# EAGLE design 8bitPig-PigstyGates-BackPCB (EAGLE 9.2.2)
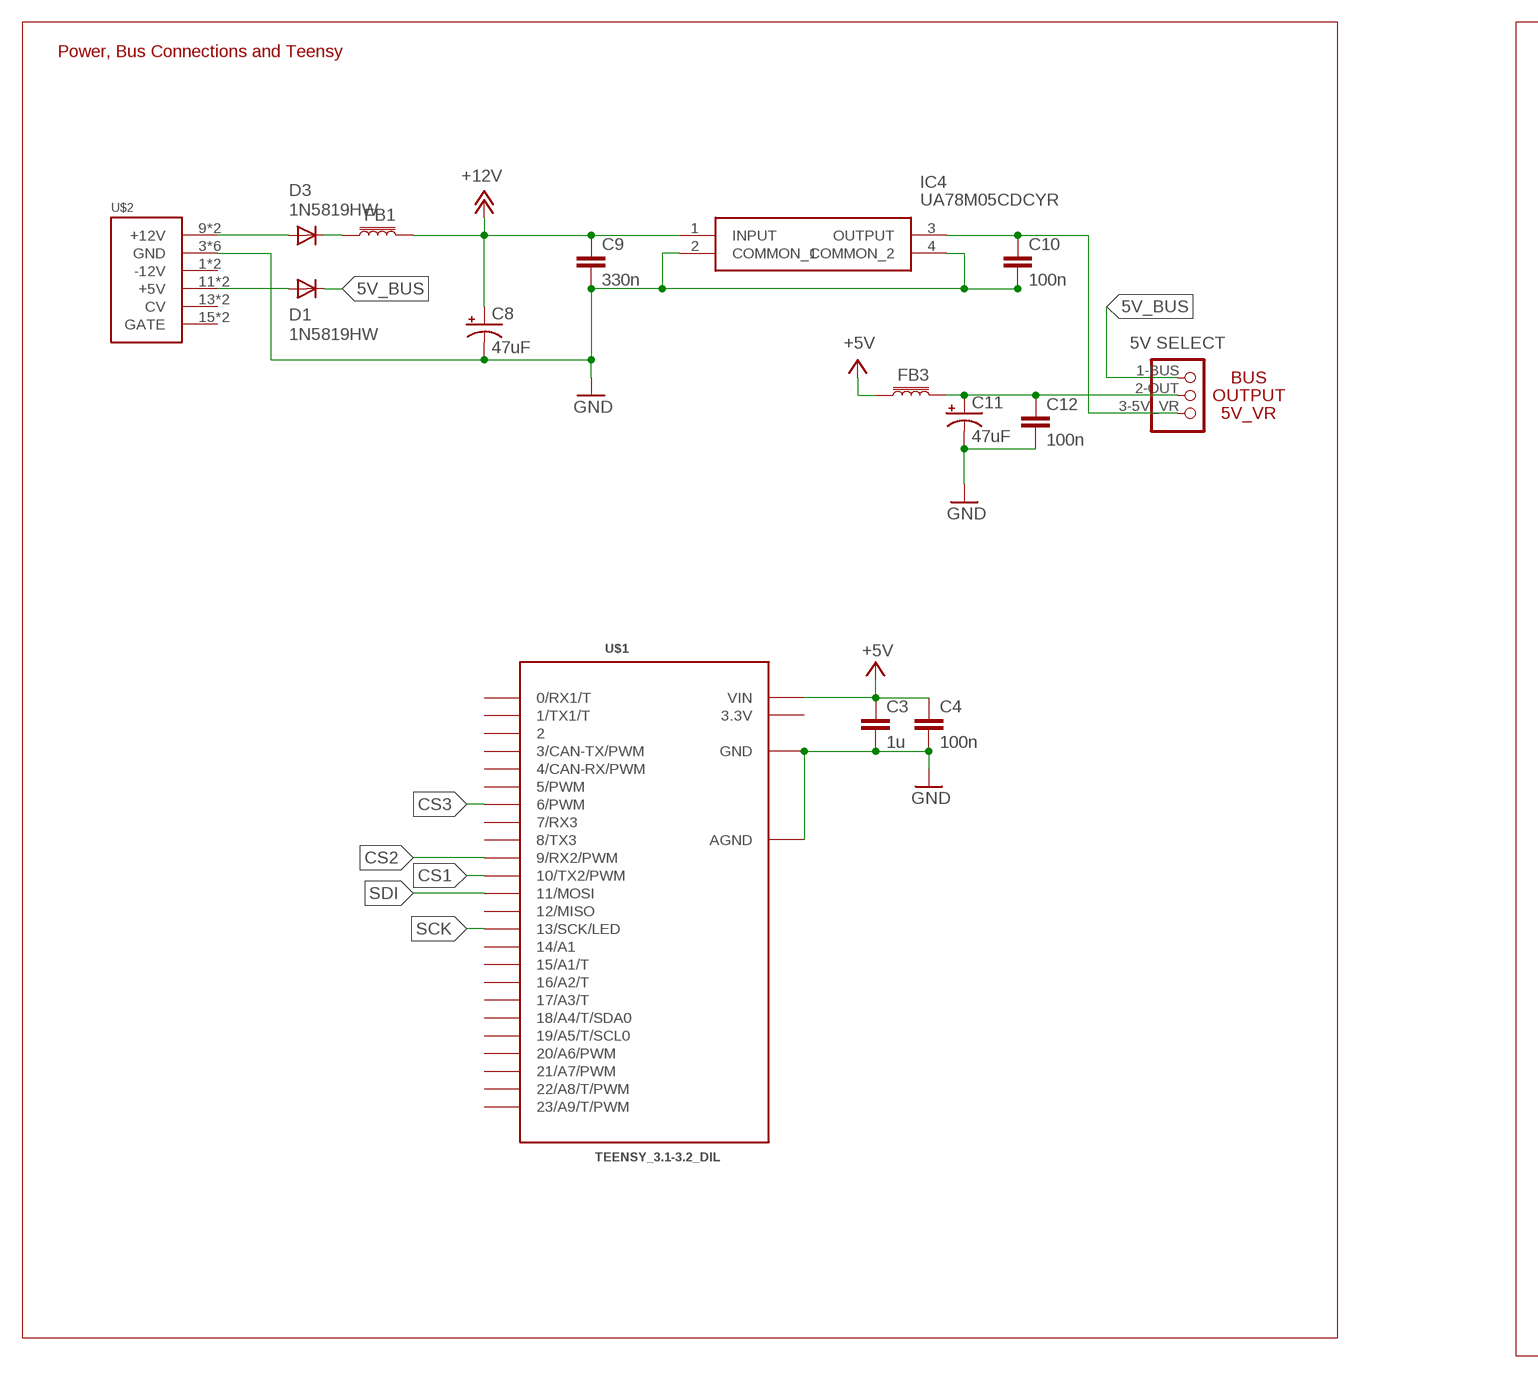
[diagram p0: schematic, sheet 1, part 1 of 2]
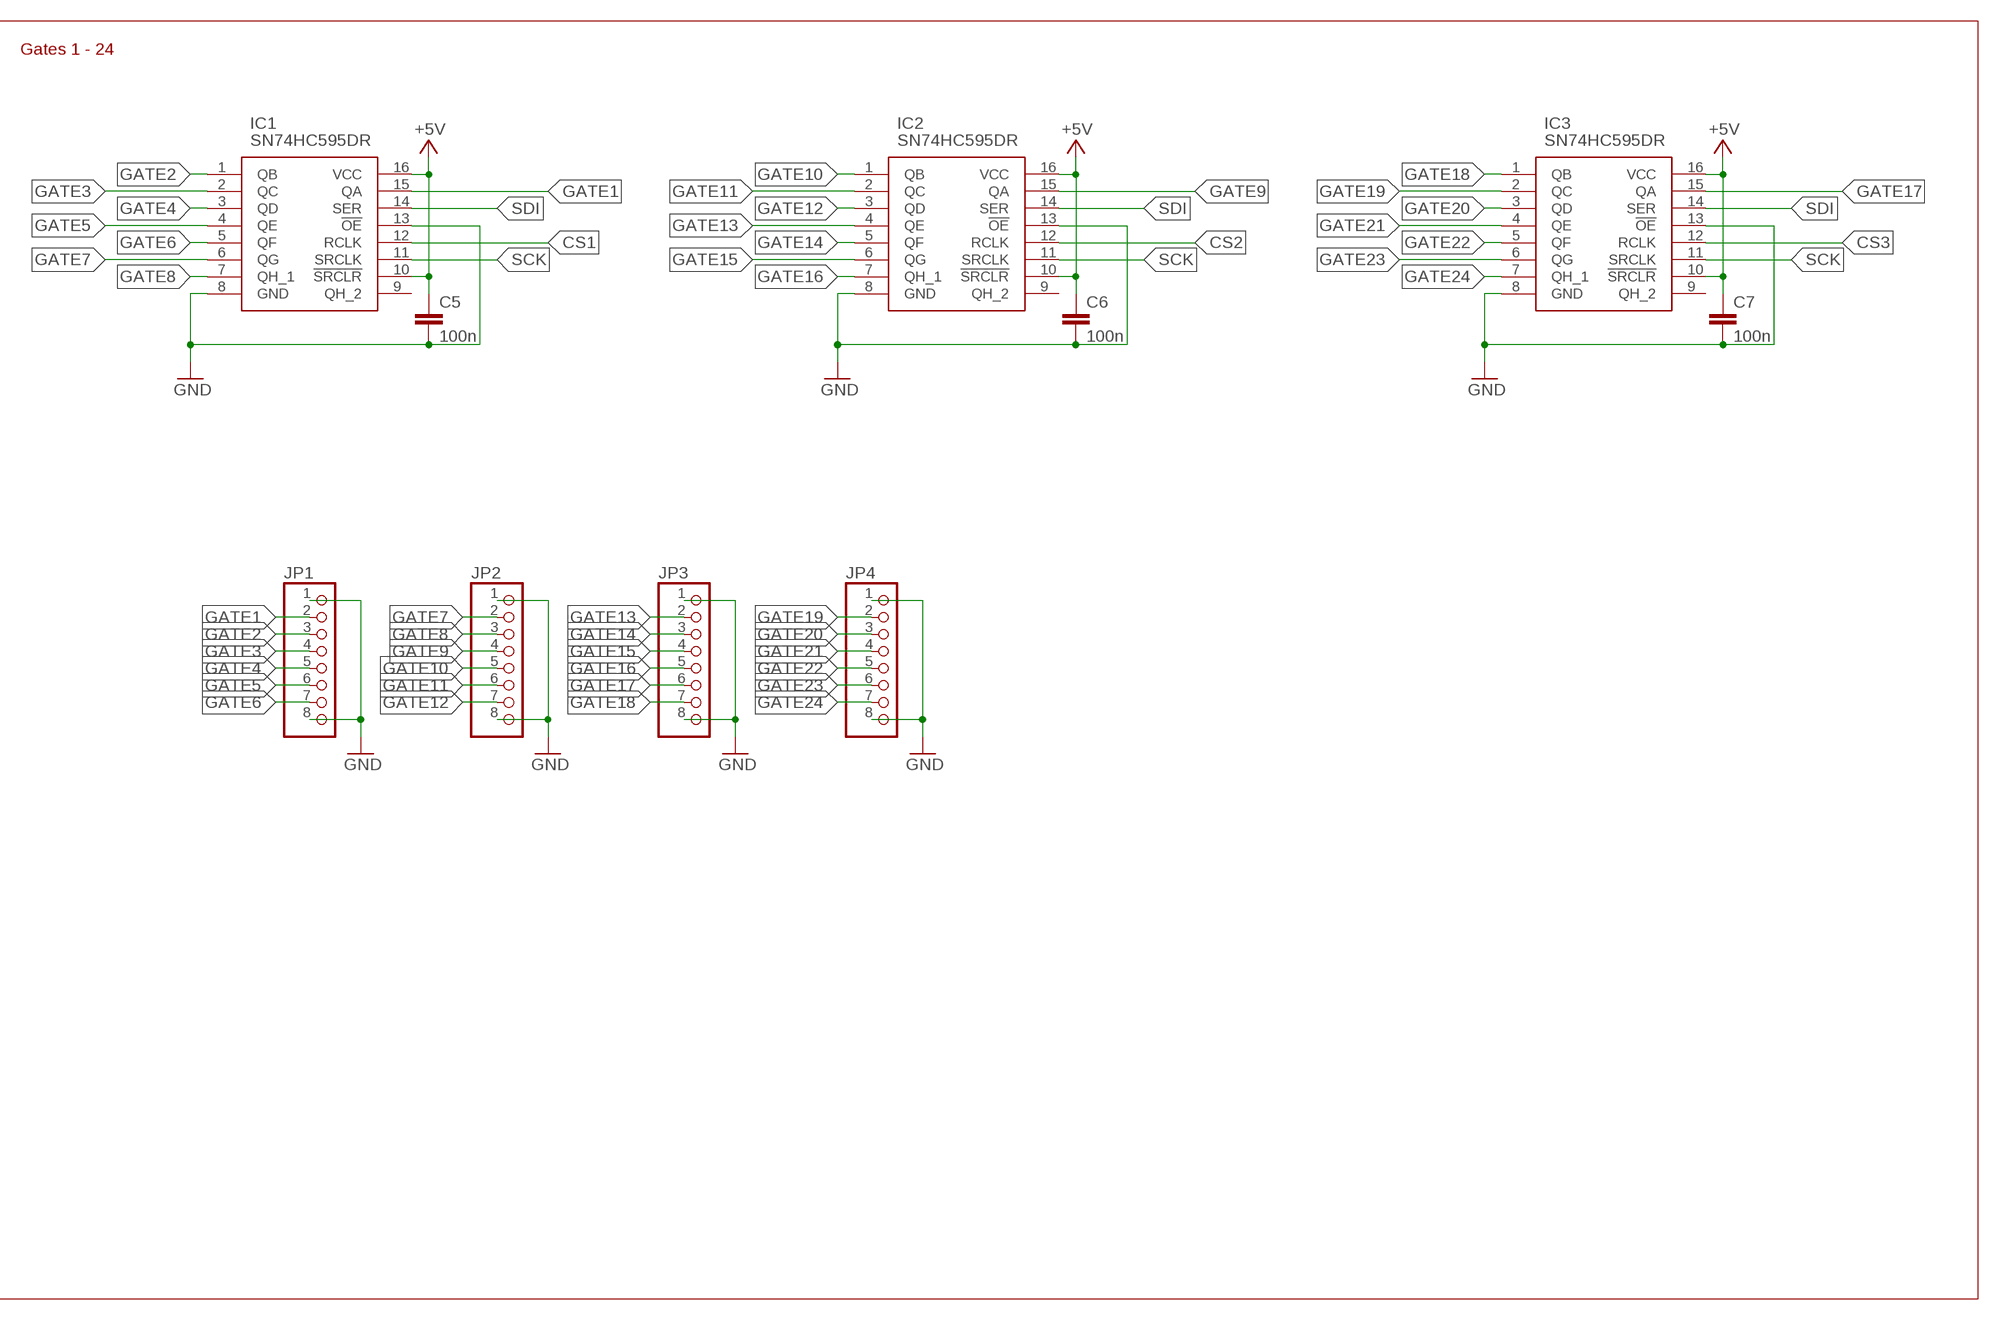
[diagram p1: schematic, sheet 1, part 2 of 2]

## Parts
C3  1u  C-EUC0603  [C0603]
C4  100n  C-EUC0603  [C0603]
C5  100n  C-EUC0603  [C0603]
C6  100n  C-EUC0603  [C0603]
C7  100n  C-EUC0603  [C0603]
C8  47uF  47UF-POLAR-PANASONIC_D-35V-20%  [PANASONIC_D]
C9  330n  C-EUC0603  [C0603]
C10  100n  C-EUC0603  [C0603]
C11  47uF  47UF-POLAR-PANASONIC_D-35V-20%  [PANASONIC_D]
C12  100n  C-EUC0603  [C0603]
D1  1N5819HW  DIODE_DIODE-SOD123  [DIODE_SOD123]
D3  1N5819HW  DIODE_DIODE-SOD123  [DIODE_SOD123]
FB1  30Ω/1.8A  FERRITE_BEAD-0603  [0603]
FB3  30Ω/1.8A  FERRITE_BEAD-0603  [0603]
IC1  SN74HC595DR  [SOIC127P600X175-16N]
IC2  SN74HC595DR  [SOIC127P600X175-16N]
IC3  SN74HC595DR  [SOIC127P600X175-16N]
IC4  UA78M05CDCYR  [SOT230P700X180-4N]
JP1  PINHD-1X8  [1X08]
JP2  PINHD-1X8  [1X08]
JP3  PINHD-1X8  [1X08]
JP4  PINHD-1X8  [1X08]
JP5  SELECTOR_POWER  [SELECTOR_POWER]
U$1  TEENSY_3.1-3.2_DIL  [TEENSY_3.0-3.2&LC_DIL]
U$2  POWER  [POWER_16]

## Nets
5V_BUS [power]: D1.C JP5.1-BUS
+5V [power]: C3.1 C4.1 C5.1 C6.1 C7.1 FB3.1 IC1.10(!SRCLR) IC1.16(VCC) IC2.10(!SRCLR) IC2.16(VCC) IC3.10(!SRCLR) IC3.16(VCC) U$1.VIN
+12V [power]: C8.+ C9.1 FB1.2 IC4.1(INPUT)
CS1 [spi]: IC1.12(RCLK) U$1.10(10/TX2/PWM)
CS2 [spi]: IC2.12(RCLK) U$1.9(9/RX2/PWM)
CS3 [spi]: IC3.12(RCLK) U$1.6(6/PWM)
GATE1: IC1.15(QA) JP1.2
GATE2: IC1.1(QB) JP1.3
GATE3: IC1.2(QC) JP1.4
GATE4: IC1.3(QD) JP1.5
GATE5: IC1.4(QE) JP1.6
GATE6: IC1.5(QF) JP1.7
GATE7: IC1.6(QG) JP2.2
GATE8: IC1.7(QH_1) JP2.3
GATE9: IC2.15(QA) JP2.4
GATE10: IC2.1(QB) JP2.5
GATE11: IC2.2(QC) JP2.6
GATE12: IC2.3(QD) JP2.7
GATE13: IC2.4(QE) JP3.2
GATE14: IC2.5(QF) JP3.3
GATE15: IC2.6(QG) JP3.4
GATE16: IC2.7(QH_1) JP3.5
GATE17: IC3.15(QA) JP3.6
GATE18: IC3.1(QB) JP3.7
GATE19: IC3.2(QC) JP4.2
GATE20: IC3.3(QD) JP4.3
GATE21: IC3.4(QE) JP4.4
GATE22: IC3.5(QF) JP4.5
GATE23: IC3.6(QG) JP4.6
GATE24: IC3.7(QH_1) JP4.7
GND [power]: C3.2 C4.2 C5.2 C6.2 C7.2 C8.- C9.2 C10.2 C11.- C12.2 IC1.8(GND) IC1.13(!OE) IC2.8(GND) IC2.13(!OE) IC3.8(GND) IC3.13(!OE) IC4.2(COMMON_1) IC4.4(COMMON_2) JP1.1 JP1.8 JP2.1 JP2.8 JP3.1 JP3.8 JP4.1 JP4.8 U$1.AGND U$1.GND U$2.3(GND) U$2.4(GND) U$2.5(GND) U$2.6(GND) U$2.7(GND) U$2.8(GND)
N$1: D3.A U$2.9(+12V) U$2.10(+12V)
N$2: D1.A U$2.11(+5V) U$2.12(+5V)
N$8: C11.+ C12.1 FB3.2 JP5.2-OUT
N$10: D3.C FB1.1
N$14: C10.1 IC4.3(OUTPUT) JP5.3-5V_VR(3-VR)
SCK [spi]: IC1.11(SRCLK) IC2.11(SRCLK) IC3.11(SRCLK) U$1.13(13/SCK/LED)
SDI [spi]: IC1.14(SER) IC2.14(SER) IC3.14(SER) U$1.11(11/MOSI)
Unconnected: IC1.9(QH_2) IC2.9(QH_2) IC3.9(QH_2) U$1.0(0/RX1/T) U$1.1(1/TX1/T) U$1.2 U$1.3(3/CAN-TX/PWM) U$1.4(4/CAN-RX/PWM) U$1.5(5/PWM) U$1.7(7/RX3) U$1.8(8/TX3) U$1.12(12/MISO) U$1.14/A0(14/A1) U$1.15/A1(15/A1/T) U$1.16/A2(16/A2/T) U$1.17/A3(17/A3/T) U$1.18/A4(18/A4/T/SDA0) U$1.19/A5(19/A5/T/SCL0) U$1.20/A6(20/A6/PWM) U$1.21/A7(21/A7/PWM) U$1.22/A8(22/A8/T/PWM) U$1.23/A9(23/A9/T/PWM) U$2.1(-12V) U$2.2(-12V) U$2.13(CV) U$2.14(CV) U$2.15(GATE) U$2.16(GATE)

## Notes on the sheet
- Power, Bus Connections and Teensy | Gates 1 - 24

## Power pins joined to a net without a drawn wire
3.3V: U$1.3.3V

## Library data of the parts
C3-C7 C9 C10 C12 = resistor:C-EU: CAPACITOR, European symbol
C8 C11 = SparkFun-Capacitors:47UF-POLAR: 47µF polarized capacitors A capacitor is a passive two-terminal electrical component used to store electrical energy temporarily in an electric field.; PROD_ID: CAP-08478
D1 D3 = grids_v02:DIODE_DIODE-: DIODE
FB1 FB3 = SparkFun-Coils:FERRITE_BEAD: Ferrite Bead (blocks, cores, rings, chokes, etc.) Inductor with layers of ferrite used to suppress high frequencies. Often used to isolate high frequency noise. SparkFun Products: IOIO-OTG - V2.2 <https://www.sparkfun.com/products/13613> SparkFun SAMD21 Mini Breakout <https://www.sparkfun.com/products/13664> SparkFun 6 Degrees of Freedom Breakout - LSM6DS3 <https://www.sparkfun.com/products/13339> SparkFun SAMD21 Dev Breakout <https://www.sparkfun.com/products/13672>; PROD_ID: NDUC-07859
IC1-IC3 = SamacSys_Parts:SN74HC595DR: 8-Bit Shift Register 3-ST SN74HC595DRG4 SN74HC595DR, 8-stage Shift Register, Serial to Serial/Parallel, 2 ???????? 6 V, 16-Pin SOIC%0 Source: Datasheet <http://www.ti.com/lit/ds/symlink/sn74hc595.pdf>; DESCRIPTION: 8-Bit Shift Register 3-ST SN74HC595DRG4 SN74HC595DR, 8-stage Shift Register, Serial to Serial/Parallel, 2 ???????? 6 V, 16-Pin SOIC%0; HEIGHT: 1.75mm; MANUFACTURER_NAME: Texas Instruments; MANUFACTURER_PART_NUMBER: SN74HC595DR; MOUSER_PART_NUMBER: 595-SN74HC595DR; MOUSER_PRICE-STOCK: https://www.mouser.com/Search/Refine.aspx?Keyword=595-SN74HC595DR
IC4 = SamacSys_Parts:UA78M05CDCYR: 500-mA, 25-V, Linear Voltage Regulators Source: Datasheet <http://www.ti.com/lit/gpn/ua78m>; DESCRIPTION: 500-mA, 25-V, Linear Voltage Regulators; HEIGHT: 1.8mm; MANUFACTURER_NAME: Texas Instruments; MANUFACTURER_PART_NUMBER: UA78M05CDCYR; MOUSER_PART_NUMBER: 595-UA78M05CDCYR; MOUSER_PRICE-STOCK: https://www.mouser.com/Search/Refine.aspx?Keyword=595-UA78M05CDCYR
JP1-JP4 = pinhead:PINHD-1X8: PIN HEADER
JP5 = SchnitzelsComponents:SELECTOR_POWER: PIN HEADER
U$1 = Teensy_3_and_LC_Series_Boards_v1.4:TEENSY_3.1-3.2_DIL: Teensy 3.1 or 3.2 in a DIL Layout.
U$2 = eurorack:POWER

## Net classes
0 default: width 0.203 mm, clearance 0.305 mm
1 power: width 0.457 mm, clearance 0.508 mm
2 spi: width 0.203 mm, clearance 0.406 mm

## Board
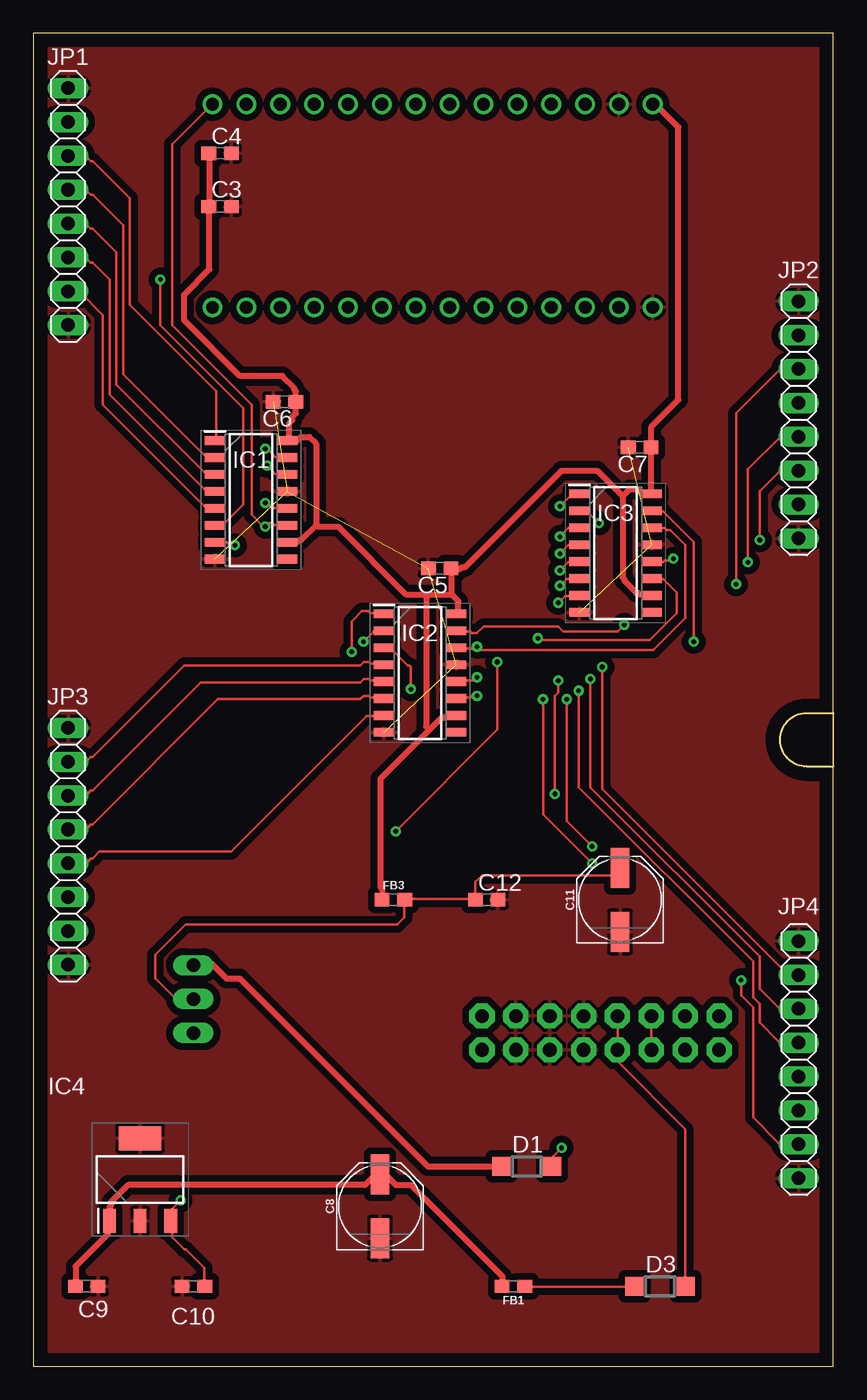
[diagram p2: board, top side]
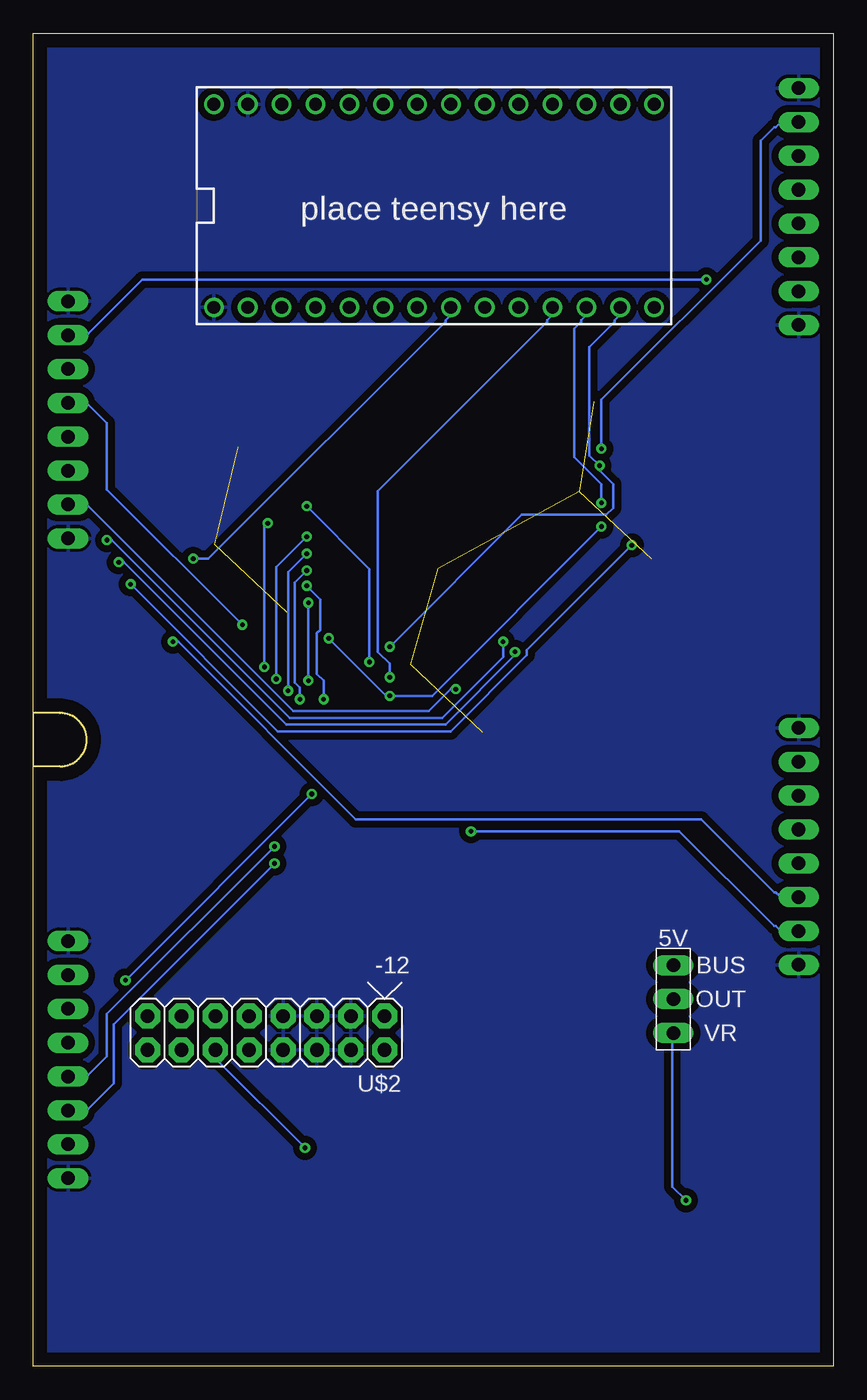
[diagram p3: board, bottom side, seen from below]

Size 60 x 100 mm. Coordinates in mm from the lower left corner, seen from the top.
Outline: 0,0 60,0 60,100 0,100 0,0
Copper layers (1*16): Top 0.035mm / dielectric 1.5mm / Bottom 0.035mm
Design rules "default": minimum track width 6mil, minimum drill 0.35mm, track to track 6mil, track to pad 6mil, pad to pad 6mil, via to via 6mil, smd to smd 6mil, copper to edge 40mil, drill to drill 6mil, minimum pad ring 10mil, minimum via ring 8mil, stop-mask expansion 4mil, vias tented up to drill 0mil, thermal gap 10mil

### Footprints (pad centres in the part's own frame; a part is rotated, then mirrored left to right if it is on the bottom)
C0603 = smd 1.1 x 1: 1 -0.85,0; 2 0.85,0
PANASONIC_D = smd 3 x 1.4: + 2.4,0; - -2.4,0
DIODE_SOD123 = smd 1.4 x 1.4: A 1.9,0; C -1.9,0
0603 = smd 1.1 x 1: 1 -0.85,0; 2 0.85,0
SOIC127P600X175-16N = smd 1.525 x 0.65: 1 -2.712,4.445; 2 -2.712,3.175; 3 -2.712,1.905; 4 -2.712,0.635; 5 -2.712,-0.635; 6 -2.712,-1.905; 7 -2.712,-3.175; 8 -2.712,-4.445; 9 2.712,-4.445; 10 2.712,-3.175; 11 2.712,-1.905; 12 2.712,-0.635; 13 2.712,0.635; 14 2.712,1.905; 15 2.712,3.175; 16 2.712,4.445
SOT230P700X180-4N = smd 1.8 x 0.95: 1 -3.1,2.3; 2 -3.1,0; 3 -3.1,-2.3 | smd 1.8 x 3.2: 4 3.1,0
1X08 = drill 1.016 long: 1 -8.89,0; 2 -6.35,0; 3 -3.81,0; 4 -1.27,0; 5 1.27,0; 6 3.81,0; 7 6.35,0; 8 8.89,0
SELECTOR_POWER = drill 1.016 long: 1-BUS 0,5.08; 2-OUT 0,2.54; 3-5V_VR 0,0
TEENSY_3.0-3.2&LC_DIL = drill 0.965: 0 -7.62,13.97; 1 -7.62,11.43; 2 -7.62,8.89; 3 -7.62,6.35; 3.3V 7.62,11.43; 4 -7.62,3.81; 5 -7.62,1.27; 6 -7.62,-1.27; 7 -7.62,-3.81; 8 -7.62,-6.35; 9 -7.62,-8.89; 10 -7.62,-11.43; 11 -7.62,-13.97; 12 -7.62,-16.51; 13 7.62,-16.51; 14/A0 7.62,-13.97; 15/A1 7.62,-11.43; 16/A2 7.62,-8.89; 17/A3 7.62,-6.35; 18/A4 7.62,-3.81; 19/A5 7.62,-1.27; 20/A6 7.62,1.27; 21/A7 7.62,3.81; 22/A8 7.62,6.35; 23/A9 7.62,8.89; AGND 7.62,13.97; GND -7.62,16.51; VIN 7.62,16.51
POWER_16 = drill 1.016 pad 1.88 octagon: 1 -6.35,-1.27; 2 -6.35,1.27; 3 -3.81,-1.27; 4 -3.81,1.27; 5 -1.27,-1.27; 6 -1.27,1.27; 7 1.27,-1.27; 8 1.27,1.27; 9 3.81,-1.27; 10 3.81,1.27; 11 6.35,-1.27; 12 6.35,1.27; 13 8.89,-1.27; 14 8.89,1.27; 15 11.43,-1.27; 16 11.43,1.27

### Placement (x,y rotation side)
C3  14,87 0 top
C4  14,91 0 top
C5  30.48,59.86 180 top
C6  18.83,72.36 180 top
C7  45.47,68.94 180 top
C8  26,12 90 top
C9  4,6 0 top
C10  12,6 180 top
C11  44,35 90 top
C12  34,35 0 top
D1  37,15 0 top
D3  47,6 0 top
FB1  36,6 180 top
FB3  27,35 0 top
IC1  16.33,65 0 top
IC2  29,52 0 top
IC3  43.67,61 0 top
IC4  8,14 90 top
JP1  2.6,87 270 top
JP2  57.4,71 270 top
JP3  2.6,39 270 top
JP4  57.4,23 270 top
JP5  12,25 0 bottom
U$1  29.95,87.06 90 bottom
U$2  40,25 180 bottom
U$3  [PANEL_CABLE_CUTOUT]  60,47 180 top

### Tracks (layer width: path | path; a pad name or v marks a point on that pad's centre or on a via)
5V_BUS  (via drill 0.35)
  Top 0.457: v12.06,30.1 12.19,30.23 13.34,30.23 14.48,29.08 15.49,29.08 29.59,14.99 35.05,14.99 D1.C
  Bottom 0.457: v12.06,30.1 JP5.1-BUS
+5V
  Top 0.457: 44.2,65.28 44.2,59.18 44.32,59.05 44.32,58.93 45.21,58.04 45.34,58.04 45.47,57.91 46.35,57.91 IC3.10 | 44.2,65.28 44.7,65.79 45.34,65.79 45.72,65.41 46.23,65.41 IC3.16 46.35,65.53 46.35,68.83 C7.1 46.35,69.09 46.35,70.48 48.39,72.52 48.39,92.96 46.74,94.61 46.48,94.61 U$1.VIN | 29.72,47.75 30.61,48.64 30.86,48.64 31.11,48.9 31.62,48.9 IC2.10 | 29.72,47.75 26.04,44.07 26.04,35.94 26.16,35.81 26.16,35.05 FB3.1 | 31.37,57.91 31.37,59.82 C5.1 31.5,59.82 32,59.82 32.13,59.94 32.38,59.94 39.62,67.18 42.29,67.18 44.2,65.28 | 31.37,57.91 31.88,57.4 31.88,56.52 31.75,56.39 IC2.16 | C4.1 13.21,90.93 13.21,87.12 C3.1 13.21,86.87 13.21,82.3 11.3,80.39 11.3,78.49 15.49,74.3 18.67,74.3 19.56,73.41 19.56,73.28 19.68,73.15 19.68,72.52 C6.1 19.68,72.26 19.68,71.5 19.43,71.25 19.43,70.99 19.18,70.74 19.18,69.47 19.05,69.34 IC1.16 19.3,69.34 19.68,69.34 20.07,69.72 20.7,69.72 21.21,69.22 21.21,63.12 | 21.21,63.12 20.07,61.98 19.94,61.98 19.81,61.85 19.05,61.85 IC1.10 | 29.46,57.91 27.94,57.91 22.86,62.99 21.34,62.99 21.21,63.12 | 29.46,57.91 31.37,57.91 | 29.46,57.91 29.46,48.01 29.72,47.75
+12V
  Top 0.457: C9.1 3.17,6.1 3.17,7.49 5.59,9.91 5.59,10.79 IC4.1 5.71,11.05 5.71,11.94 5.84,12.06 5.84,12.32 7.11,13.59 24.89,13.59 25.65,14.35 25.78,14.35 C8.+ 26.04,14.35 26.42,14.35 27.18,13.59 28.32,13.59 35.18,6.73 35.18,6.1 FB1.2
CS1  (via drill 0.35)
  Top 0.203: v17.4,64.77 17.65,64.52 17.91,64.52 18.03,64.39 18.92,64.39 IC1.12
  Bottom 0.203: v17.4,64.77 17.4,66.17 19.43,68.2 19.43,77.85 18.92,78.36 18.92,78.49 18.54,78.87 18.54,79.38 U$1.10
CS2  (via drill 0.35)
  Top 0.203: v33.27,51.69 33.02,51.44 31.75,51.44 IC2.12
  Bottom 0.203: v33.27,51.69 33.27,52.7 34.16,53.59 34.16,65.66 21.46,78.36 21.46,78.49 21.08,78.87 21.08,79.38 U$1.9
CS3  (via drill 0.35)
  Top 0.203: v48.01,60.58 47.75,60.58 47.62,60.45 47.37,60.45 47.24,60.33 46.48,60.33 IC3.12
  Bottom 0.203: v48.01,60.58 46.86,60.58 29.08,78.36 29.08,78.49 28.7,78.87 28.7,79.38 U$1.6
GATE1  (via drill 0.35)
  Top 0.203: v17.4,68.83 17.53,68.83 18.16,68.2 18.92,68.2 IC1.15
  Bottom 0.203: v17.4,68.83 17.4,72.52 5.46,84.45 5.46,91.95 4.45,92.96 4.32,92.96 3.94,93.34 2.67,93.34 JP1.2
GATE2
  Top 0.203: IC1.1 13.72,69.47 13.72,73.15 7.24,79.63 7.24,87.63 4.45,90.42 4.32,90.42 3.94,90.81 2.67,90.81 JP1.3
GATE3
  Top 0.203: IC1.2 13.59,68.2 12.95,68.2 6.73,74.42 6.73,85.6 4.45,87.88 4.32,87.88 3.94,88.27 2.67,88.27 JP1.4
GATE4
  Top 0.203: IC1.3 13.59,66.93 12.95,66.93 6.22,73.66 6.22,83.57 4.45,85.34 4.32,85.34 3.94,85.72 2.67,85.72 JP1.5
GATE5
  Top 0.203: IC1.4 13.59,65.66 12.95,65.66 5.71,72.9 5.71,81.53 4.45,82.8 4.32,82.8 3.94,83.19 2.67,83.19 JP1.6
GATE6
  Top 0.203: IC1.5 13.59,64.39 12.95,64.39 5.21,72.14 5.21,78.87 3.43,80.64 2.67,80.64 JP1.7
GATE7  (via drill 0.35)
  Top 0.203: v9.53,81.53 9.53,78.11 15.75,71.88 15.75,64.64 14.22,63.12 13.72,63.12 IC1.6
  Bottom 0.203: v9.53,81.53 51.82,81.53 55.88,77.47 57.28,77.47 JP2.2
GATE8  (via drill 0.35)
  Top 0.203: v15.11,61.59 14.99,61.72 14.61,61.72 14.48,61.85 13.72,61.85 IC1.7 | v52.7,58.67 52.7,71.5 56.01,74.8 57.28,74.8 JP2.3
  Bottom 0.203: v15.11,61.59 22.99,53.72 22.99,53.34 28.7,47.62 41.66,47.62 v52.7,58.67
GATE9  (via drill 0.35)
  Top 0.203: v44.32,55.63 43.81,55.12 39.75,55.12 39.37,55.5 33.78,55.5 33.27,54.99 32.89,54.99 32.77,55.12 31.75,55.12 IC2.15
  Bottom 0.203: v44.32,55.63 54.48,65.79 54.48,70.74 56.01,72.26 57.28,72.26 JP2.4
GATE10  (via drill 0.35)
  Top 0.203: v23.88,53.59 23.88,55.88 24.64,56.64 25.15,56.64 25.27,56.52 26.16,56.52 IC2.1 | v53.59,60.33 53.59,67.31 56.01,69.72 57.28,69.72 JP2.5
  Bottom 0.203: v23.88,53.59 23.88,53.34 29.08,48.13 41.02,48.13 53.21,60.33 v53.59,60.33
GATE11  (via drill 0.35)
  Top 0.203: v24.77,54.36 25.53,55.12 26.16,55.12 IC2.2 | v54.48,61.98 54.48,65.66 56.01,67.18 57.28,67.18 JP2.6
  Bottom 0.203: v24.77,54.36 24.77,53.21 29.34,48.64 40.77,48.64 54.1,61.98 v54.48,61.98
GATE12  (via drill 0.35)
  Top 0.203: v28.32,50.8 28.32,52.45 28.19,52.58 28.07,52.58 26.8,53.85 26.29,53.85 IC2.3
  Bottom 0.203: v28.32,50.8 28.7,50.8 30.35,49.15 40.51,49.15 56.01,64.64 57.28,64.64 JP2.7
GATE13
  Top 0.203: IC2.4 26.16,52.7 25.27,52.7 25.15,52.83 24.77,52.83 24.51,52.58 11.3,52.58 4.45,45.72 4.32,45.72 4.06,45.47 2.67,45.47 JP3.2
GATE14
  Top 0.203: IC2.5 26.16,51.44 25.27,51.44 25.15,51.56 24.77,51.56 24.51,51.31 12.57,51.31 4.45,43.18 4.32,43.18 4.06,42.93 2.67,42.93 JP3.3
GATE15
  Top 0.203: IC2.6 26.16,50.16 25.27,50.16 25.15,50.29 24.77,50.29 24.51,50.04 13.84,50.04 4.45,40.64 4.32,40.64 4.06,40.39 2.67,40.39 JP3.4
GATE16
  Top 0.203: IC2.7 26.16,48.77 25.02,48.77 14.86,38.61 4.95,38.61 4.45,38.1 4.32,38.1 4.06,37.85 2.67,37.85 JP3.5
GATE17  (via drill 0.35)
  Top 0.203: v49.53,54.36 49.53,61.85 47.24,64.14 46.48,64.14 IC3.15
  Bottom 0.203: v49.53,54.36 49.15,54.36 35.81,41.02 9.91,41.02 4.45,35.56 4.32,35.56 4.06,35.31 2.67,35.31 JP3.6
GATE18  (via drill 0.35)
  Top 0.203: v39.5,64.52 40.39,65.41 40.89,65.41 IC3.1 | v34.8,52.83 34.8,47.75 v27.18,40.13
  Bottom 0.203: v39.5,64.52 34.8,59.82 v34.8,52.83 | v27.18,40.13 11.56,40.13 4.45,33.02 4.32,33.02 4.06,32.77 2.67,32.77 JP3.7
GATE19  (via drill 0.35)
  Top 0.203: v42.42,63.25 41.53,64.14 41.02,64.14 IC3.2 | v42.67,52.45 42.67,43.31 56.52,29.46 57.28,29.46 JP4.2
  Bottom 0.203: v42.42,63.25 42.67,62.99 v42.67,52.45
GATE20  (via drill 0.35)
  Top 0.203: v39.5,62.23 40.13,62.87 40.89,62.87 IC3.3 | v41.78,51.56 41.78,43.43 54.48,30.73 54.48,28.32 55.88,26.92 57.28,26.92 JP4.3
  Bottom 0.203: v39.5,62.23 41.78,59.94 v41.78,51.56
GATE21  (via drill 0.35)
  Top 0.203: v39.5,60.96 40.13,61.59 40.89,61.59 IC3.4 | v40.89,50.67 40.89,43.43 53.98,30.35 53.98,27.69 54.48,27.18 54.48,25.78 55.88,24.38 57.28,24.38 JP4.4
  Bottom 0.203: v39.5,60.96 40.89,59.56 v40.89,50.67
GATE22  (via drill 0.35)
  Top 0.203: v39.5,59.69 40.13,60.33 40.89,60.33 IC3.5 | v40.01,50.04 40.01,40.89 v41.91,38.99
  Bottom 0.203: v39.5,59.69 40.39,58.8 40.39,51.31 40.01,50.93 v40.01,50.04 | v41.91,38.99 54.48,26.42 54.48,23.24 55.88,21.84 57.28,21.84 JP4.5
GATE23  (via drill 0.35)
  Top 0.203: v39.5,58.55 40.01,59.05 40.89,59.05 IC3.6 | v38.23,50.04 38.23,41.4 v41.91,37.72
  Bottom 0.203: v39.5,58.55 38.48,57.53 38.48,55.24 38.73,54.99 38.73,51.94 38.23,51.44 v38.23,50.04 | v41.91,37.72 53.98,25.65 53.98,21.21 55.88,19.3 57.28,19.3 JP4.6
GATE24  (via drill 0.35)
  Top 0.203: v39.37,57.28 39.88,57.78 40.89,57.78 IC3.7 | v39.37,51.44 39.37,50.55 39.12,50.29 v39.12,42.93 | v53.09,28.96 53.09,27.81 53.98,26.92 53.98,18.67 55.88,16.76 57.28,16.76 JP4.7
  Bottom 0.203: v39.37,51.44 v39.37,57.28 | v53.09,28.96 v39.12,42.93
GND  (7 unrouted)
  pour Top: 1,99 59,99 59,1 1,1
  pour Bottom: 1,99 59,99 59,1 1,1
N$1
  Top 0.203: D3.A 48.9,6.1 48.9,17.78 43.81,22.86 43.81,23.62 U$2.10 43.81,23.75 43.81,26.16 U$2.9
N$2  (via drill 0.35)
  Top 0.203: v39.62,16.38 38.99,15.75 38.99,15.11 D1.A | U$2.11 46.35,26.16 46.35,23.75 U$2.12
  Bottom 0.203: v39.62,16.38 46.23,22.99 46.23,23.62 U$2.12
N$8  (via drill 0.35)
  Top 0.203: 33.15,35.05 27.94,35.05 FB3.2 27.81,34.92 27.81,33.66 27.3,33.15 11.43,33.15 9.14,30.86 9.14,29.08 10.67,27.56 v11.94,27.56 | 33.15,35.05 33.15,36.32 33.66,36.83 43.43,36.83 43.94,37.34 C11.+ | 33.15,35.05 C12.1
  Bottom 0.203: v11.94,27.56 JP5.2-OUT
N$10
  Top 0.203: FB1.1 36.96,5.97 45.09,5.97 D3.C
N$14  (via drill 0.35)
  Top 0.203: C10.1 12.83,6.1 12.83,7.37 11.43,8.76 11.3,8.76 10.41,9.65 10.41,10.79 IC4.3 10.41,10.92 10.41,11.81 v11.05,12.45 | v12.06,24.89 JP5.3-5V_VR
  Bottom 0.203: v12.06,24.89 12.06,13.46 v11.05,12.45
SCK  (via drill 0.35)
  Top 0.203: 17.4,63.12 17.53,63.25 17.91,63.25 18.03,63.12 18.92,63.12 IC1.11 | 17.4,63.12 17.14,63.12 16.38,63.88 16.38,72.14 10.41,78.11 10.41,91.69 13.34,94.61 U$1.13 | v33.27,50.29 32.89,50.29 32.77,50.16 31.75,50.16 IC2.11 | 17.4,63.12 v17.4,62.99 | v37.85,54.61 37.97,54.48 46.23,54.48 48.26,56.52 48.26,58.04 47.24,59.05 46.48,59.05 IC3.11
  Bottom 0.203: v17.4,62.99 30.1,50.29 v33.27,50.29 33.53,50.29 v37.85,54.61
SDI  (via drill 0.35)
  Top 0.203: v17.53,67.56 18.16,66.93 18.92,66.93 IC1.14 | 33.08,53.78 33.15,53.72 46.48,53.72 48.9,56.13 48.9,61.59 47.75,62.74 47.5,62.74 47.37,62.87 46.48,62.87 IC3.14 | 33.08,53.78 33.02,53.85 31.75,53.85 IC2.14 | 33.08,53.78 v33.27,53.98
  Bottom 0.203: U$1.11 16,79.38 16,78.87 16.38,78.49 16.38,78.36 18.29,76.45 18.29,68.33 v17.53,67.56 17.53,67.18 16.51,66.17 16.51,64.39 17.02,63.88 23.37,63.88 v33.27,53.98

### Text on the board
bPlace: place teensy here